# Altium schematic sheet SCH.SchDoc
size C
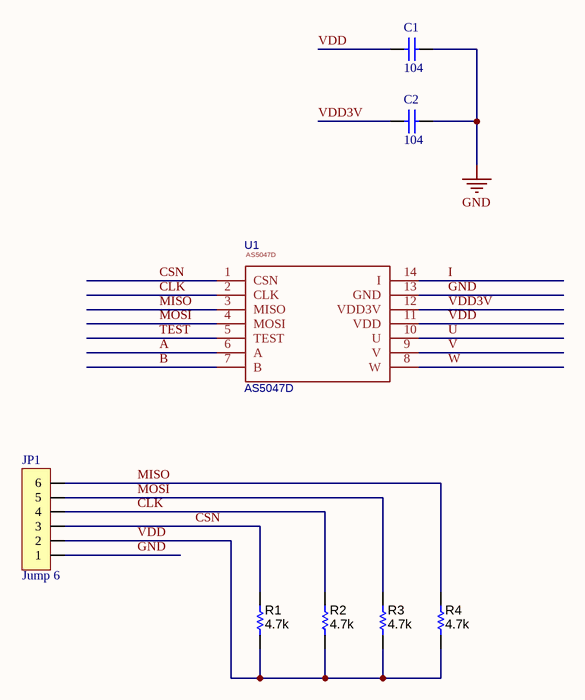
[diagram p0: SCH.SchDoc]

## Parts
C1  104  [TU_SMD_0805]
C2  104  [TU_SMD_0805]
JP1  Jump 6  [ZH 1.5 6P]
R1  4.7k  [Tro SMD 0805]
R2  4.7k  [Tro SMD 0805]
R3  4.7k  [Tro SMD 0805]
R4  4.7k  [Tro SMD 0805]
U1  AS5047D  [TSSOP14]

## Nets
GND: C1.2 C2.2 JP1.1 U1.13(GND)
A: U1.6(A)
B: U1.7(B)
CLK: JP1.4 R2.1 U1.2(CLK)
CSN: JP1.3 R1.1 U1.1(CSN)
I: U1.14(I)
MISO: JP1.6 R4.1 U1.3(MISO)
MOSI: JP1.5 R3.1 U1.4(MOSI)
TEST: U1.5(TEST)
U: U1.10(U)
V: U1.9(V)
VDD: C1.1 JP1.2 R1.2 R2.2 R3.2 R4.2 U1.11(VDD)
VDD3V: C2.1 U1.12(VDD3V)
W: U1.8(W)

## Library data of the parts
C1 C2 = Capacitor 0805: Ceramic Chip Capacitor - Standard; Note: Footprint corresponds to dimensions for bulk cassette packaging. This case size has tightened tolerances.; Published: 17-Jul-2002; LatestRevisionDate: 19-Mar-2004; LatestRevisionNote: Silkscreen size reduced.; DatasheetDocument: Mar-2001; PackageDocument: Mar-2001; PackageReference: 0805; Publisher: Altium Limited; Code_JEITA: 0805; Code_IPC: 2012[0805]; ComponentLink1Description: Manufacturer Link; ComponentLink1URL: http://www.kemet.com/; ComponentLink2Description: Datasheet; ComponentLink2URL: http://www.kemet.com/kemet/web/homepage/kechome.nsf/vapubfilesname/F3102TA.pdf/$file/F3102TA.pdf; Value: 104
JP1 = Jump 6: Jump 6P 2.54
R1-R4 = R nho: RES, 100, 1%, 0.1 W, 0402; PartNumber: ERJ-2RKF1000X; Manufacturer: Panasonic; CompType: Resistor; Res_ohm: 100; Value_Code: 100R; Tolerance_%: 1; Power_W: 0.1; Value2: 0.1W; VDC_V: 50; TempCo: 100 ppm/C; EIA_Code: E96; U/M: EA; AEC Category: Q200; SymbolVersion: 2009-05-29; PackageReference: 0402; RoHS: Y; Value1: 1%; MountType: SMT; Technology: Thick Film; Published: 2008-06-26; Publisher: Texas Instruments; LatestRevisionDate: 2016-01-08; ComponentLink1Description: Datasheet link; ComponentLink1URL: http://industrial.panasonic.com/www-data/pdf/AOA0000/AOA0000CE2.pdf; Supplier 1: Digi-Key; Supplier Part Number 1: P100LCT-ND; Supplier 2: Mouser; Supplier Part Number 2: 667-ERJ-2RKF1000X; Supplier 3: Farnell; Supplier Part Number 3: 2304034; AEC Qualified: ?; Value: 4.7k
U1 = AS5047D: BOM_Manufacturer Part: ?; spicePre: U; Supplier 1: Digi-Key; Supplier Part Number 1: AS5047D-ATSMTR-ND